# Altium schematic sheet 1.POWER.SchDoc
size A4
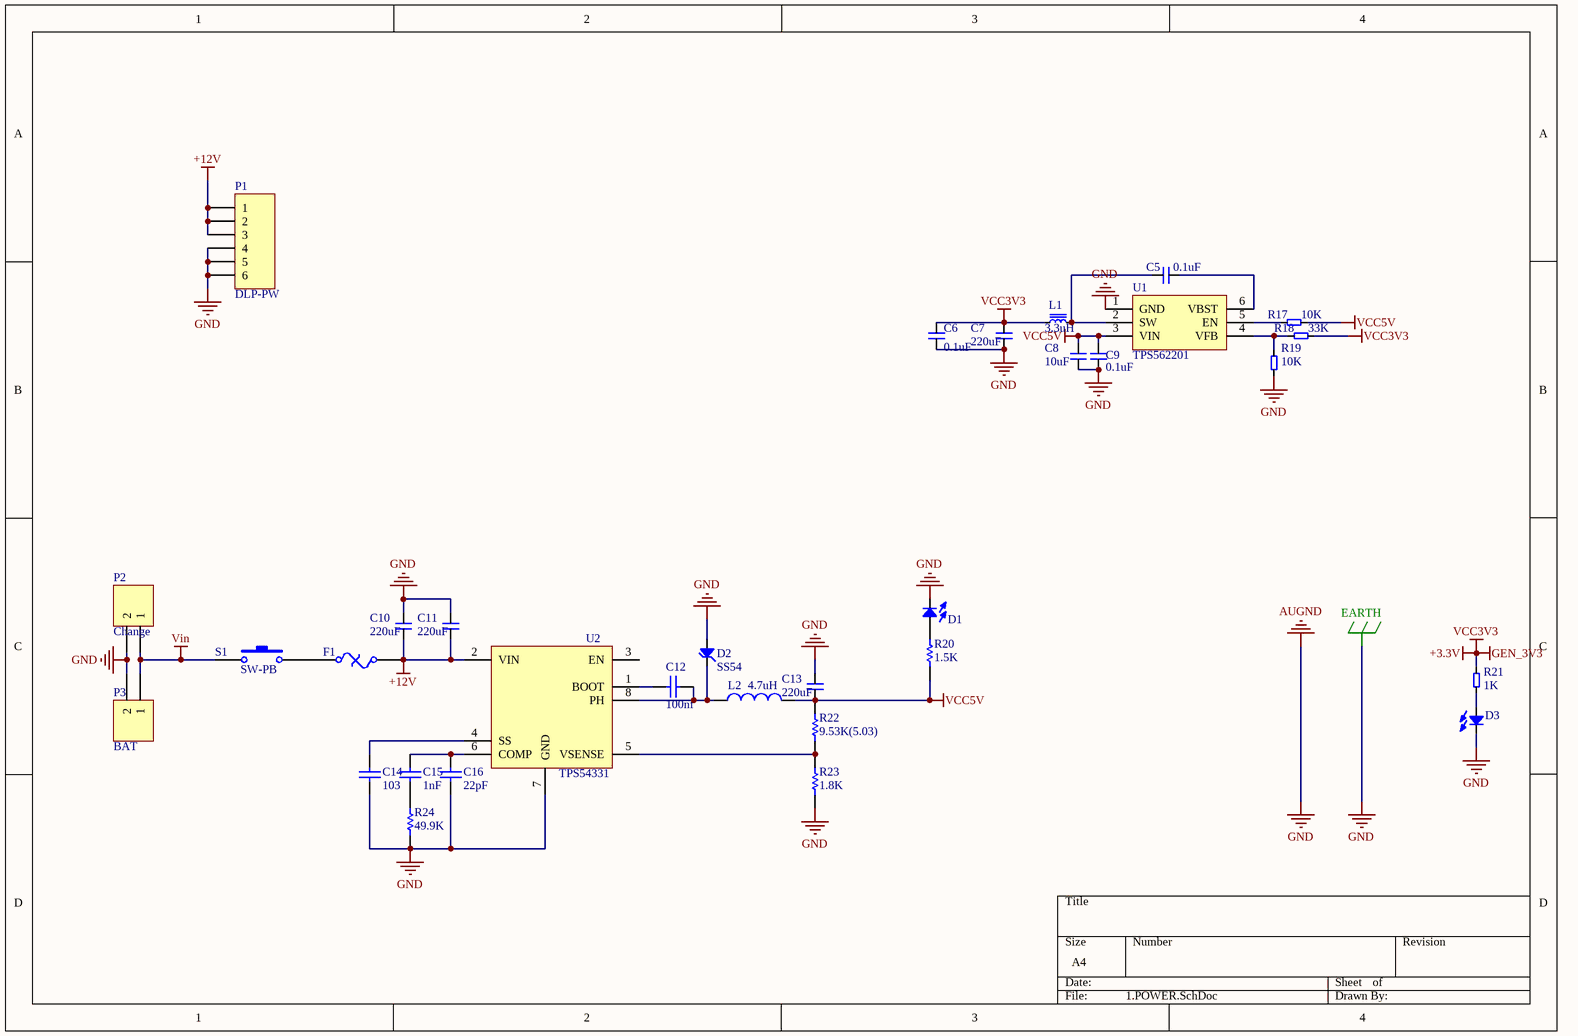
[diagram p0: 1.POWER.SchDoc]

## Parts
C5  0.1uF  [0603C]
C6  0.1uF  [0603C]
C7  220uF  [1210C]
C8  10uF  [0603C]
C9  0.1uF  [0603C]
C10  220uF  [1210C]
C11  220uF  [1210C]
C12  value 100nf  [0603C]  (hidden comment: Cap)
C13  220uF  [1210C]
C14  value 103  [0603C]  (hidden comment: Cap)
C15  value 1nF  [0603C]  (hidden comment: Cap)
C16  value 22pF  [0603C]  (hidden comment: Cap)
D1  发光二极管  [0603D]  (value not drawn)
D2  SS54  [SMA]
D3  发光二极管  [0603D]  (value not drawn)
F1  Fuse Thermal  [1812F]  (value not drawn)
L1  3.3uH  [L4030]
L2  value 4.7uH  [L-6045]  (hidden comment: Inductor)
P1  DLP-PW  [SH1.0-6P]
P2  Change  [DC-005]
P3  BAT  [XH2.54-2P]
R17  10K  [0603R]
R18  33K  [0603R]
R19  10K  [0603R]
R20  value 1.5K  [0603R]  (hidden comment: Res1)
R21  1K  [0603R]
R22  value 9.53K(5.03)  [0603R]  (hidden comment: Res Semi)
R23  value 1.8K  [0603R]  (hidden comment: Res Semi)
R24  value 49.9K  [0603R]  (hidden comment: Res Semi)
S1  SW-PB  [SPST-2]
U1  TPS562201  [SOT23-6-DC]
U2  TPS54331  [SOP8-POW]

## Nets
+3.3V: C6.1 C7.1 L1.1 R18.1 R21.2  [also labelled GEN_3V3, VCC3V3]
+12V: C10.2 C11.2 F1.2 P1.1 P1.2 P1.3 U2.2(VIN)
AUGND: C6.2 C7.2 C8.2 C9.2 C10.1 C11.1 C13.1 C14.2 C16.1 D1.K D2.A D3.K P1.4 P1.5 P1.6 P2.2 P3.2 R19.1 R23.1 R24.1 U1.1(GND) U2.7(GND) U2.9(PAD)  [also labelled EARTH, GND]
VCC5V: C8.1 C9.1 C13.2 L2.2 R17.1 R20.1 R22.2 U1.3(VIN)
Vin: P2.1 P3.1 S1.1
NetC5_1: C5.1 L1.2 U1.2(SW)
NetC5_2: C5.2 U1.6(VBST)
NetC12_1: C12.1 D2.K L2.1 U2.8(PH)
NetC12_2: C12.2 U2.1(BOOT)
NetC14_1: C14.1 U2.4(SS)
NetC15_1: C15.1 R24.2
NetC15_2: C15.2 C16.2 U2.6(COMP)
NetD1_A: D1.A R20.2
NetD3_A: D3.A R21.1
NetF1_1: F1.1 S1.2
NetR17_2: R17.2 U1.5(EN)
NetR18_2: R18.2 R19.2 U1.4(VFB)
NetR22_1: R22.1 R23.2 U2.5(VSENSE)

Not connected (* = marked no-connect by the designer): U2 3(EN)

## Library data of the parts
C5-C11 C13 = 电容
C12 C14-C16 = Cap: Capacitor; Published: 8-Jun-2000; LatestRevisionDate: 17-Jul-2002; LatestRevisionNote: Re-released for DXP Platform.; PackageReference: RAD-0.3; Publisher: Altium Limited
  C14-C16: PackageDescription: Radial Cap, Thru-Hole; 2 Leads; 0.3 in Pin Spacing
D2 = SS24: DIODES: *
F1 = Fuse Thermal: Thermal Fuse; Published: 24-Mar-1999; LatestRevisionDate: 17-Jul-2002; LatestRevisionNote: Re-released for DXP Platform.; PackageReference: PIN-W2/E2.8; Publisher: Altium Limited
L1 = 功率电感
L2 = Inductor: Code_IEC: 1005; Published: 8-Jun-2000; LatestRevisionDate: 17-Jul-2002; LatestRevisionNote: Re-released for DXP Platform.; PackageReference: 0402-A; Publisher: Altium Limited; Code_JEITA: 0402
P1 = Header 6: Header, 6-Pin; LatestRevisionDate: 17-Jul-2002; LatestRevisionNote: Re-released for DXP Platform.; Publisher: Altium Limited
P2 P3 = Header 2: Header, 2-Pin; LatestRevisionDate: 17-Jul-2002; LatestRevisionNote: Re-released for DXP Platform.; Publisher: Altium Limited
R17-R19 R21 = 电阻
R20 = Res1: Resistor; Published: 8-Jun-2000; LatestRevisionDate: 17-Jul-2002; LatestRevisionNote: Re-released for DXP Platform.; PackageReference: AXIAL-0.3; Publisher: Altium Limited
R22-R24 = Res Semi: Semiconductor Resistor; Published: 8-Jun-2000; LatestRevisionDate: 17-Jul-2002; LatestRevisionNote: Re-released for DXP Platform.; PackageReference: AXIAL-0.5; Publisher: Altium Limited; PackageDescription: Axial Device, Thru-Hole; 2 Leads; 0.5 in Pin Spacing
S1 = SW-PB: Switch; Published: 24-Mar-1999; LatestRevisionDate: 17-Jul-2002; LatestRevisionNote: Re-released for DXP Platform.; PackageReference: SPST-2; Publisher: Altium Limited